# EAGLE design PeriphDB-DiffUart (EAGLE 5.10)
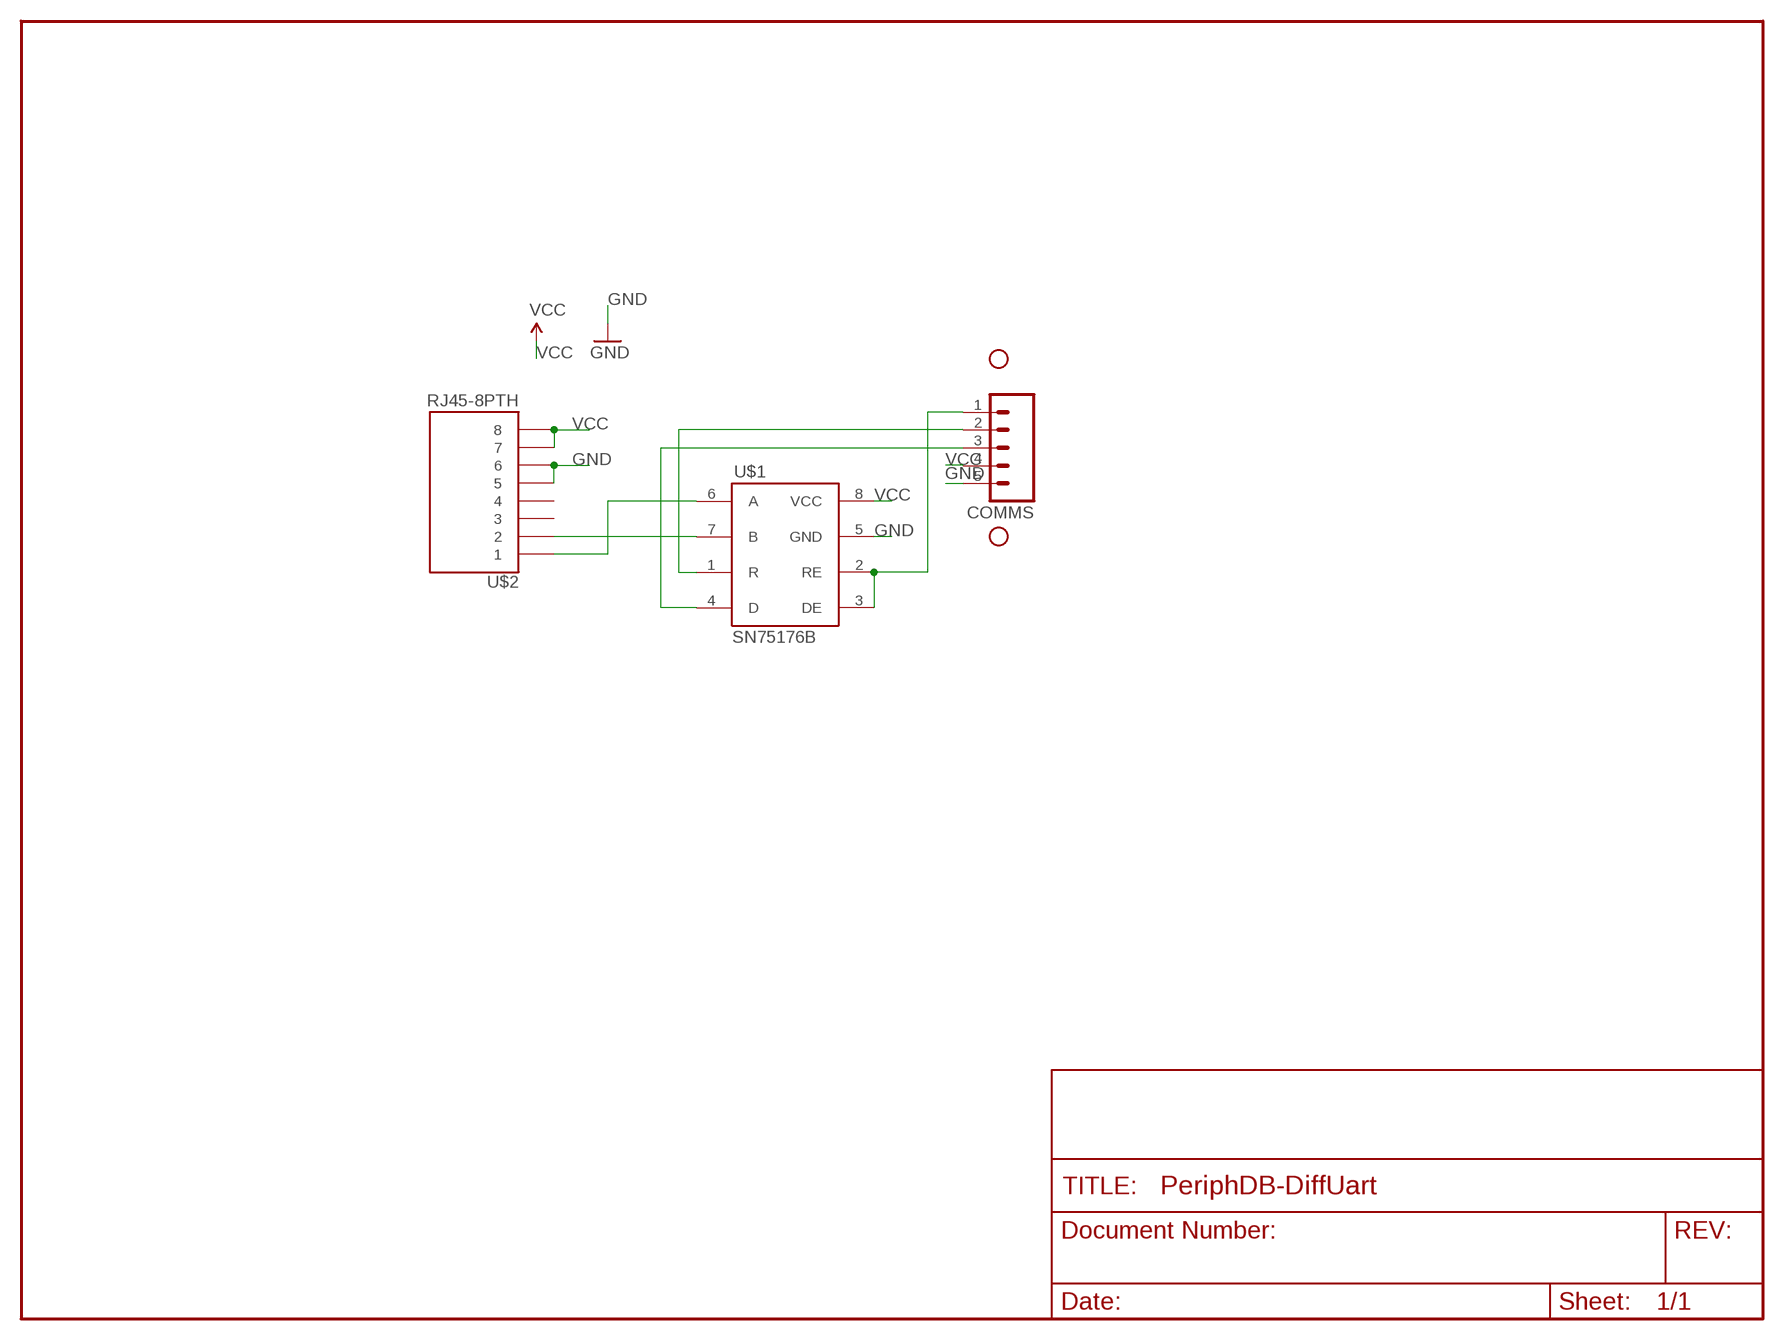
[diagram p0: schematic, sheet 1]

## Parts
COMMS  M05LOCK  [1X05_LOCK]
JP29  STAND-OFF  [STAND-OFF]
JP30  STAND-OFF  [STAND-OFF]
U$1  SN75176B  [DIL08]
U$2  RJ45-8PTH  [RJ45-8]

## Nets
GND: COMMS.5 U$1.5(GND) U$2.5 U$2.6
N$1: U$1.6(A) U$2.1
N$2: U$1.7(B) U$2.2
N$3: COMMS.1 U$1.2(RE) U$1.3(DE)
N$4: COMMS.2 U$1.1(R)
N$5: COMMS.3 U$1.4(D)
VCC: COMMS.4 U$1.8(VCC) U$2.7 U$2.8
Unconnected: U$2.3 U$2.4

## Library data of the parts
COMMS = SparkFun:M05: Header 5 Standard 5-pin 0.1" header. Use with straight break away headers (SKU : PRT-00116), right angle break away headers (PRT-00553), swiss pins (PRT-00743), machine pins (PRT-00117), and female headers (PRT-00115). Molex polarized connector foot print use with SKU : PRT-08230 with associated crimp pins and housings.
JP29 JP30 = SparkFun:STAND-OFF: Stand Off This is the mechanical footprint for a #4 phillips button head screw. Use the keepout ring to avoid running the screw head into surrounding components. SKU : PRT-00447
U$1 = SparkFun:SN75176
U$2 = SparkFun:RJ45-8: RJ45 Jack Simple RJ45, 8-pin connection - connector for common Cat5, Cat5e, and Cat6 Ethernet cables. Footprint not yet proven in production. Connector sku is PRT-00643; Breakout PCB sku is BOB-00716.

## Board
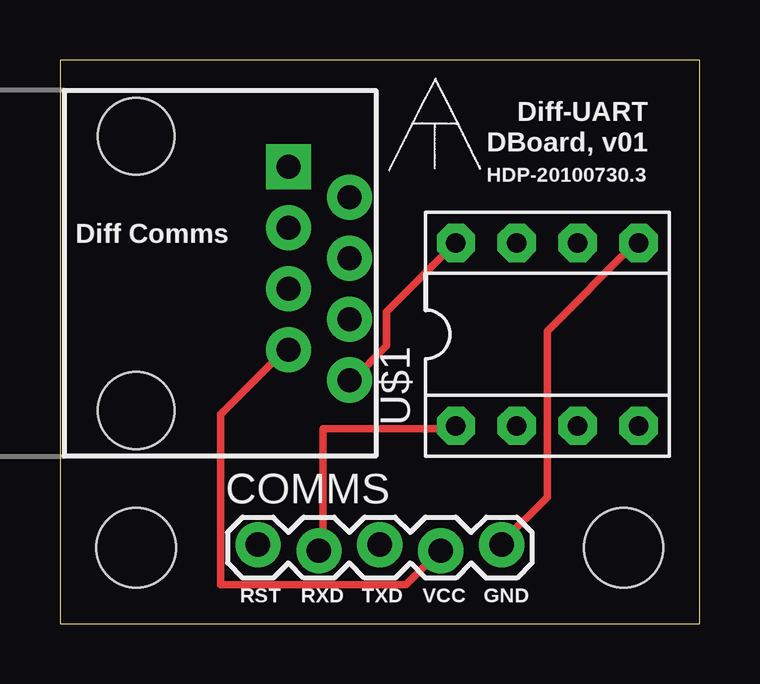
[diagram p1: board, top side]
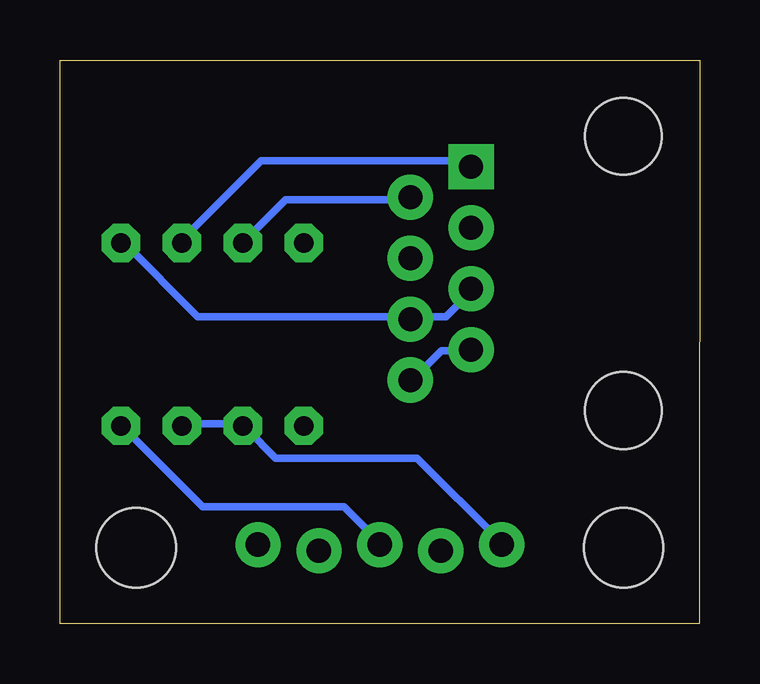
[diagram p2: board, bottom side, seen from below]

Size 26.67 x 23.5 mm. Coordinates in mm from the lower left corner, seen from the top.
Outline: 0.01,0 26.67,0 26.67,23.5 0,23.48 0.01,0
Copper layers (1*16): Top 0.0356mm / dielectric 1.5011mm / Bottom 0.0356mm
Design rules "LaenPCBOrder *": minimum track width 12mil, minimum drill 13mil, track to track 12mil, track to pad 12mil, pad to pad 12mil, via to via 12mil, smd to smd 6mil, copper to edge 15mil, drill to drill 12mil, minimum pad ring 7mil, minimum via ring 7mil, stop-mask expansion 4mil, vias tented up to drill 0mil, thermal gap 10mil

### Footprints (pad centres in the part's own frame; a part is rotated, then mirrored left to right if it is on the bottom)
1X05_LOCK = drill 1.016 pad 1.88 round: 1 0,0.127; 2 2.54,-0.127; 3 5.08,0.127; 4 7.62,-0.127; 5 10.16,0.127
STAND-OFF = hole 3.302: 0,0
DIL08 = drill 0.813 pad 1.6 octagon: 1 -3.81,-3.81; 2 -1.27,-3.81; 3 1.27,-3.81; 4 3.81,-3.81; 5 3.81,3.81; 6 1.27,3.81; 7 -1.27,3.81; 8 -3.81,3.81
RJ45-8 = drill 1 pad 1.88 square: 1 -4.445,6.35 | drill 1 pad 1.88 round: 2 -3.175,8.89; 3 -1.905,6.35; 4 -0.635,8.89; 5 0.635,6.35; 6 1.905,8.89; 7 3.175,6.35; 8 4.445,8.89 | hole 3.2: -5.715,0; 5.715,0

### Placement (x,y rotation side)
COMMS  8.26,3.17 0 top
JP29  3.17,3.17 0 top
JP30  23.5,3.17 0 top
U$1  20.32,12.06 0 top
U$2  3.17,14.61 270 top

### Tracks (layer width: path | path; a pad name or v marks a point on that pad's centre or on a via)
GND
  Top 0.305: COMMS.5 18.49,3.45 20.32,5.28 20.32,12.19 23.98,15.85 U$1.5
  Bottom 0.305: U$1.5 23.98,15.85 20.93,12.8 12.19,12.8 U$2.6 11.99,12.8 10.57,12.8 9.55,13.82 U$2.5
N$1
  Bottom 0.305: U$1.6 21.54,16.05 18.29,19.3 9.75,19.3 9.55,19.1 U$2.1
N$2
  Bottom 0.305: U$1.7 18.9,16.05 17.27,17.68 12.19,17.68 U$2.2
N$3
  Bottom 0.305: U$1.3 21.54,8.33 19.1,8.33 U$1.2 18.9,8.13 17.68,6.91 11.79,6.91 8.33,3.45 COMMS.1
N$4
  Top 0.305: U$1.1 16.46,8.13 10.97,8.13 10.97,3.05 COMMS.2
N$5
  Bottom 0.305: U$1.4 23.98,8.13 20.73,4.88 14.83,4.88 13.41,3.45 COMMS.3
VCC
  Top 0.305: U$1.8 16.46,15.85 13.61,13.01 13.61,11.58 12.19,10.16 U$2.8 | COMMS.4 15.85,3.05 14.43,1.63 6.71,1.63 6.71,8.74 9.35,11.38 U$2.7
  Bottom 0.305: U$2.8 11.99,10.16 10.77,11.38 9.55,11.38 U$2.7

### Text on the board
tPlace: Diff-UART | DBoard, v01 | HDP-20100730.3 | Diff Comms | RST | RXD | TXD | VCC | GND